# EAGLE design spedo_pcb_1 (EAGLE 6.6.0)
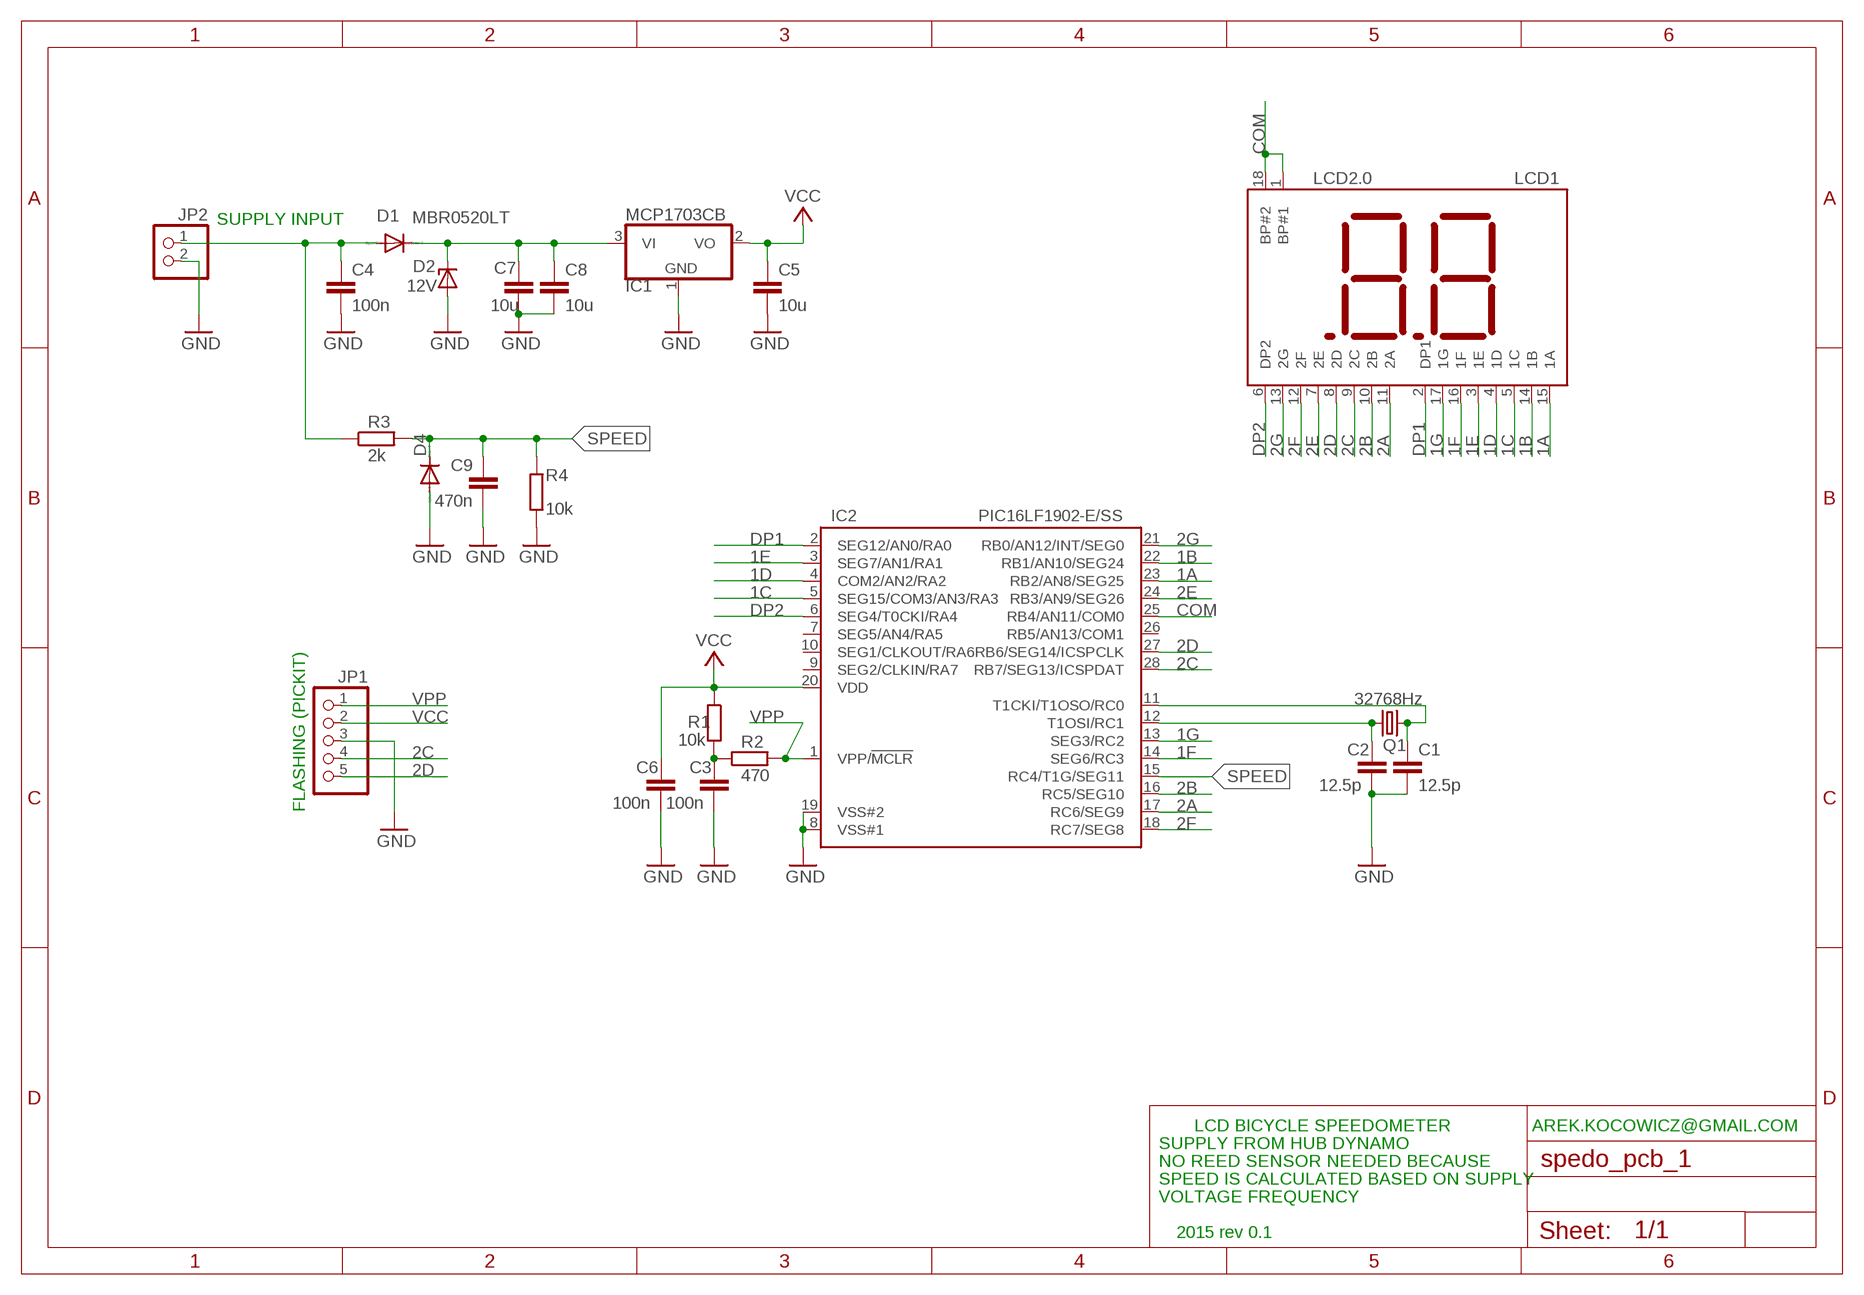
[diagram p0: schematic, sheet 1]

## Parts
C1  12.5p  C-EUC0603K  [C0603K]
C2  12.5p  C-EUC0603K  [C0603K]
C3  100n  C-EUC0603K  [C0603K]
C4  100n  C-EUC0603K  [C0603K]
C5  10u  C-EUC0805K  [C0805K]
C6  100n  C-EUC0603K  [C0603K]
C7  10u  C-EUC0805K  [C0805K]
C8  10u  C-EUC0805K  [C0805K]
C9  470n  C-EUC0603K  [C0603K]
D1  MBR0520LT  [SOD123]
D2  12V  ZENER-DIODESOD80C  [SOD80C]
D4  DIODE-SOD323-W  [SOD323-W]
IC1  MCP1703CB  [SOT23]
IC2  PIC16LF1902-E/SS  [SSOP28]
JP1  PINHD-1X5/90  [1X05/90]
JP2  PINHD-1X2  [1X02]
LCD1  LCD2.0  [LCD2.0]
Q1  32768Hz  CRYSTALTC26H  [TC26H]
R1  10k  R-EU_R0603  [R0603]
R2  470  R-EU_R0603  [R0603]
R3  2k  R-EU_R0603  [R0603]
R4  10k  R-EU_R0603  [R0603]

## Nets
1A: IC2.23(RB2/AN8/SEG25) LCD1.15(1A)
1B: IC2.22(RB1/AN10/SEG24) LCD1.14(1B)
1C: IC2.5(SEG15/COM3/AN3/RA3) LCD1.5(1C)
1D: IC2.4(COM2/AN2/RA2) LCD1.4(1D)
1E: IC2.3(SEG7/AN1/RA1) LCD1.3(1E)
1F: IC2.14(SEG6/RC3) LCD1.16(1F)
1G: IC2.13(SEG3/RC2) LCD1.17(1G)
2A: IC2.17(RC6/SEG9) LCD1.11(2A)
2B: IC2.16(RC5/SEG10) LCD1.10(2B)
2C: IC2.28(RB7/SEG13/ICSPDAT) JP1.4 LCD1.9(2C)
2D: IC2.27(RB6/SEG14/ICSPCLK) JP1.5 LCD1.8(2D)
2E: IC2.24(RB3/AN9/SEG26) LCD1.7(2E)
2F: IC2.18(RC7/SEG8) LCD1.12(2F)
2G: IC2.21(RB0/AN12/INT/SEG0) LCD1.13(2G)
COM: IC2.25(RB4/AN11/COM0) LCD1.1(BP#1) LCD1.18(BP#2)
DP1: IC2.2(SEG12/AN0/RA0) LCD1.2(DP1)
DP2: IC2.6(SEG4/T0CKI/RA4) LCD1.6(DP2)
GND: C1.2 C2.2 C3.2 C4.2 C5.2 C6.2 C7.2 C8.2 C9.2 D2.A D4.A IC1.1(GND) IC2.8(VSS#1) IC2.19(VSS#2) JP1.3 JP2.2 R4.2
N$1: C1.1 IC2.11(T1CKI/T1OSO/RC0) Q1.2
N$2: C2.1 IC2.12(T1OSI/RC1) Q1.1
N$3: C4.1 D1.A JP2.1 R3.1
N$5: C3.1 R1.2 R2.1
N$6: C7.1 C8.1 D1.C D2.C IC1.3(VI)
SPEED: C9.1 D4.C IC2.15(RC4/T1G/SEG11) R3.2 R4.1
VCC: C5.1 C6.1 IC1.2(VO) IC2.20(VDD) JP1.2 R1.1
VPP: IC2.1(VPP/!MCLR) JP1.1 R2.2
Unconnected: IC2.7(SEG5/AN4/RA5) IC2.9(SEG2/CLKIN/RA7) IC2.10(SEG1/CLKOUT/RA6) IC2.26(RB5/AN13/COM1)

## Notes on the sheet
- SUPPLY INPUT
- FLASHING (PICKIT)
- LCD BICYCLE SPEEDOMETER | AREK.KOCOWICZ@GMAIL.COM
- SUPPLY FROM HUB DYNAMO
- NO REED SENSOR NEEDED BECAUSE
- SPEED IS CALCULATED BASED ON SUPPLY
- VOLTAGE FREQUENCY
- 2015 rev 0.1

## Library data of the parts
C1-C9 = rcl:C-EU: CAPACITOR, European symbol
D1 = diode:MBR0520LT: SCHOTTKY BARRIER RECTIFIER Source: http://onsemi.com .. MBR0520LT1-D.pdf
D2 = diode:ZENER-DIODE: Z-Diode
D4 = diode:DIODE-: DIODE
IC1 = linear:MCP1703: 250 mA, 16V, Low Quiescent Current LDO Regulator Source: http://ww1.microchip.com/downloads/en/DeviceDoc/22049b.pdf
IC2 = pic16:PIC16LF1902-E/SS
JP1 = pinhead:PINHD-1X5: PIN HEADER
JP2 = pinhead:PINHD-1X2: PIN HEADER
LCD1 = LCD:LCD2.0
Q1 = crystal:CRYSTAL: CRYSTAL; OC_FARNELL: unknown; OC_NEWARK: unknown
R1-R4 = rcl:R-EU_: RESISTOR, European symbol

## Board
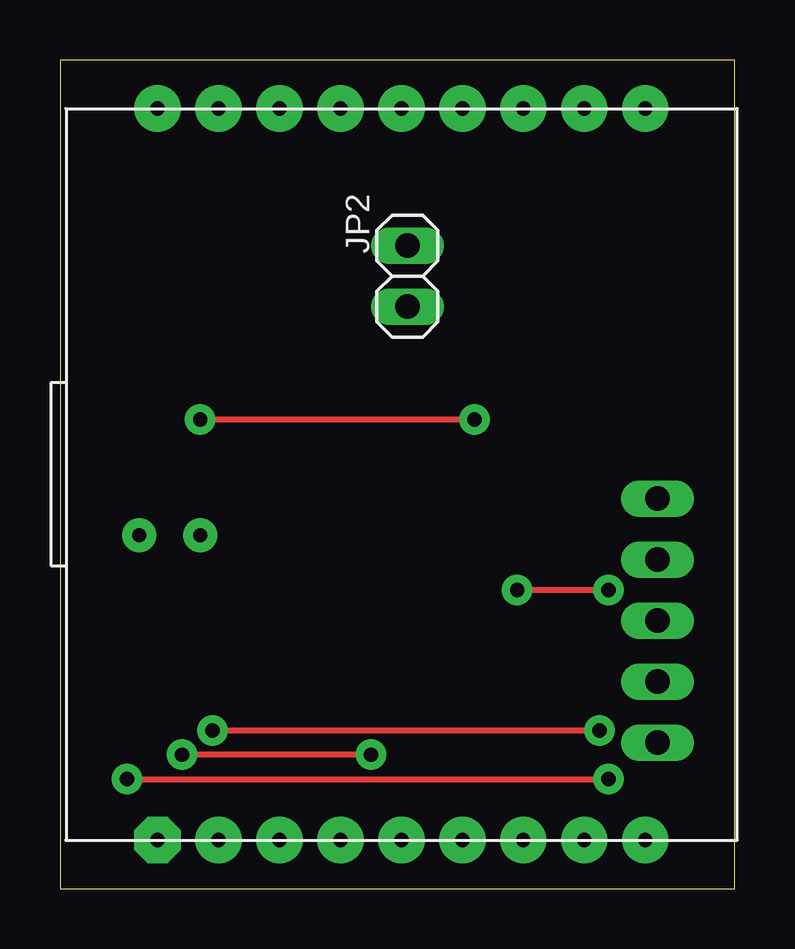
[diagram p1: board, top side]
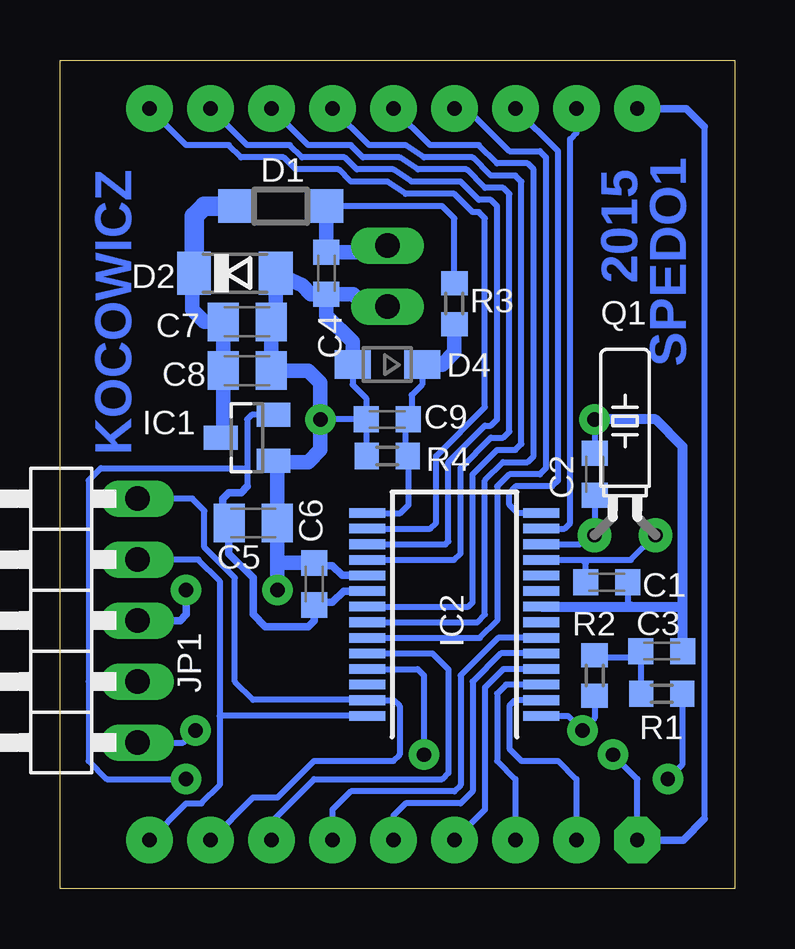
[diagram p2: board, bottom side, seen from below]

Size 28.12 x 34.53 mm. Coordinates in mm from the lower left corner, seen from the top.
Outline: 0,0 28.12,0 28.12,34.53 0,34.53 0,0
Copper layers (1*16): Top 0.035mm / dielectric 1.5mm / Bottom 0.035mm
Design rules "default": minimum track width 10mil, minimum drill 24mil, track to track 8mil, track to pad 8mil, pad to pad 8mil, via to via 8mil, smd to smd 8mil, copper to edge 40mil, drill to drill 8mil, minimum pad ring 10mil, minimum via ring 8mil, stop-mask expansion 4mil, vias tented up to drill 0mil, thermal gap 10mil

### Footprints (pad centres in the part's own frame; a part is rotated, then mirrored left to right if it is on the bottom)
C0603K = smd 1.05 x 1.08: 1 -0.875,0; 2 0.875,0
C0805K = smd 1.3 x 1.6: 1 -1,0; 2 1,0
SOD123 = smd 1.4 x 1.4: A 1.9,0; C -1.9,0
SOD80C = smd 1.4 x 1.8: A 1.7,0; C -1.7,0
SOD323-W = smd 1.5 x 1.2: A 1.45,0; C -1.45,0
SOT23 = smd 1 x 1.4: 1 -0.95,-1.1; 2 0.95,-1.1; 3 0,1.1
SSOP28 = smd 0.4 x 1.5: 1 -4.225,-3.625; 2 -3.575,-3.625; 3 -2.925,-3.625; 4 -2.275,-3.625; 5 -1.625,-3.625; 6 -0.975,-3.625; 7 -0.325,-3.625; 8 0.325,-3.625; 9 0.975,-3.625; 10 1.625,-3.625; 11 2.275,-3.625; 12 2.925,-3.625; 13 3.575,-3.625; 14 4.225,-3.625; 15 4.225,3.625; 16 3.575,3.625; 17 2.925,3.625; 18 2.275,3.625; 19 1.625,3.625; 20 0.975,3.625; 21 0.325,3.625; 22 -0.325,3.625; 23 -0.975,3.625; 24 -1.625,3.625; 25 -2.275,3.625; 26 -2.925,3.625; 27 -3.575,3.625; 28 -4.225,3.625
1X05/90 = drill 1.016 long: 1 -5.08,-3.81; 2 -2.54,-3.81; 3 0,-3.81; 4 2.54,-3.81; 5 5.08,-3.81
1X02 = drill 1.016 long: 1 -1.27,0; 2 1.27,0
LCD2.0 = drill 0.6 pad 1.93 octagon: 1 -10.16,-15.24 | drill 0.6 pad 1.93: 2 -7.62,-15.24; 3 -5.08,-15.24; 4 -2.54,-15.24; 5 0,-15.24; 6 2.54,-15.24; 7 5.08,-15.24; 8 7.62,-15.24; 9 10.16,-15.24; 10 10.16,15.24; 11 7.62,15.24; 12 5.08,15.24; 13 2.54,15.24; 14 0,15.24; 15 -2.54,15.24; 16 -5.08,15.24; 17 -7.62,15.24; 18 -10.16,15.24
TC26H = drill 0.6 pad 1.4: 1 -1.27,0; 2 1.27,0
R0603 = smd 1 x 1.1: 1 -0.85,0; 2 0.85,0

### Placement (x,y rotation side)
C1  5.33,12.78 0 bottom
C2  5.84,17.27 90 bottom
C3  3.05,9.91 0 bottom
C4  17.02,25.65 270 bottom
C5  20.07,15.24 0 bottom
C6  17.53,12.7 90 bottom
C7  20.32,23.62 0 bottom
C8  20.32,21.59 0 bottom
C9  14.48,19.56 180 bottom
D1  18.92,28.45 0 bottom
D2  20.83,25.65 0 bottom
D4  14.48,21.84 180 bottom
IC1  20.32,18.8 90 bottom
IC2  11.68,11.43 90 bottom
JP1  28.7,11.18 90 bottom
JP2  14.48,25.53 270 top
LCD1  14.22,17.27 0 top
Q1  4.57,14.73 0 bottom
R1  3.05,8.13 180 bottom
R2  5.84,8.89 270 bottom
R3  11.68,24.38 270 bottom
R4  14.48,18.03 180 bottom

### Tracks (layer width: path | path; a pad name or v marks a point on that pad's centre or on a via)
1A
  Bottom 0.254: LCD1.15 11.18,32.51 9.4,30.73 8.13,30.73 7.87,30.48 7.87,17.53 8.13,17.27 9.4,17.27 9.91,16.76 9.91,11.18 10.63,10.45 IC2.23
1B
  Bottom 0.254: IC2.22 10.74,11.1 10.41,11.43 10.41,17.02 9.65,17.78 8.64,17.78 8.38,18.03 8.38,29.97 8.64,30.23 9.91,30.23 10.67,30.99 12.7,30.99 LCD1.14
1C
  Bottom 0.254: IC2.5 9.75,9.8 10.92,8.64 10.92,4.06 11.43,3.56 13.72,3.56 14.22,3.05 LCD1.5
1D
  Bottom 0.254: IC2.4 9.64,9.16 10.41,8.38 10.41,3.3 LCD1.4
1E
  Bottom 0.254: IC2.3 9.53,8.51 9.91,8.13 9.91,5.33 9.14,4.57 LCD1.3
1F
  Bottom 0.254: IC2.14 9.05,15.66 9.4,16 9.4,16.51 9.14,16.76 7.62,16.76 7.37,17.02 7.37,30.73 LCD1.16
1G
  Bottom 0.254: LCD1.17 6.6,31.5 6.86,31.24 6.86,15.24 7.09,15.01 IC2.13
2A
  Bottom 0.254: IC2.17 12.06,14.35 11.94,14.48 11.94,17.78 10.41,19.3 10.16,19.3 9.91,19.56 9.91,28.45 10.16,28.7 10.67,28.7 11.43,29.46 13.46,29.46 14.22,29.97 15.75,29.97 16.26,30.48 18.03,30.48 18.54,30.99 20.32,30.99 LCD1.11
2B
  Bottom 0.254: IC2.16 12.68,15.01 12.45,15.24 12.45,18.03 10.41,20.07 10.41,27.94 10.67,28.19 10.92,28.19 11.68,28.96 13.72,28.96 14.48,29.46 16,29.46 16.51,29.97 18.29,29.97 18.8,30.48 20.57,30.48 21.08,30.99 22.86,30.99 LCD1.10
2C
  Bottom 0.254: 21.46,7.2 21.46,12.83 22.35,13.72 JP1.4 | 21.46,7.2 21.46,4.32 22.22,3.56 22.86,3.56 LCD1.9 | IC2.28 21.46,7.2
2D
  Bottom 0.254: LCD1.8 20.07,3.81 19.05,3.81 17.53,5.33 14.22,5.33 13.97,5.59 13.97,7.62 14.21,7.85 IC2.27 15.33,7.87 20.07,7.87 20.83,8.64 20.83,12.95 22.1,14.22 22.1,15.75 22.61,16.26 JP1.5
2E
  Bottom 0.254: IC2.24 12.6,9.8 11.94,9.14 11.94,4.83 12.19,4.57 17.53,4.57 19.3,2.79 LCD1.7
2F
  Bottom 0.254: IC2.18 11.7,13.7 11.43,13.97 11.43,17.53 10.16,18.8 9.65,18.8 9.4,19.05 9.4,28.96 9.65,29.21 10.41,29.21 11.18,29.97 13.21,29.97 13.97,30.48 15.49,30.48 16,30.99 17.78,30.99 LCD1.12
2G
  Bottom 0.254: IC2.21 11.11,11.76 10.92,11.94 10.92,17.27 9.91,18.29 9.14,18.29 8.89,18.54 8.89,29.46 9.14,29.72 10.16,29.72 10.92,30.48 12.95,30.48 13.72,30.99 15.24,30.99 LCD1.13
COM  (via drill 0.6 pad 1.27)
  Top 0.254: v12.95,5.59 v5.08,5.59
  Bottom 0.254: 1.27,31.75 1.27,2.92 | IC2.25 13.22,9.16 12.95,8.89 v12.95,5.59 | v5.08,5.59 4.06,4.57 LCD1.1
  Bottom 0.305: 1.27,2.92 2.16,2.03 LCD1.1 | 1.27,31.75 2.03,32.51 LCD1.18
DP1
  Bottom 0.254: IC2.2 9.16,7.85 9.4,7.62 9.4,5.84 8.89,5.33 7.37,5.33 6.6,4.57 LCD1.2
DP2
  Bottom 0.254: IC2.6 9.86,10.45 11.43,8.89 11.43,4.32 11.68,4.06 16,4.06 16.76,3.3 LCD1.6
GND  (via drill 0.6 pad 1.27)
  Top 0.254: v5.84,19.56 v17.27,19.56 | v22.86,12.45 v19.05,12.45
  Bottom 0.254: 17.41,13.46 C6.2 | 19.13,23.31 C7.2 | 2.24,11.76 2.17,11.68 | C1.2 4.46,11.9 4.32,11.76 | v5.84,19.56 C2.2 | 17.25,19.53 v17.27,19.56 C9.2 | D4.A 15.93,21.01 15.37,20.45 15.37,19.57 C9.2 | R4.2 15.33,19.53 C9.2 | C5.2 18.81,15.24
  Bottom 0.305: IC2.19 16.36,13.05 16.76,13.46 17.41,13.46 | JP1.3 23.11,11.18 22.86,11.43 v22.86,12.45
  Bottom 0.406: C3.2 2.17,11.68 2.17,18.43 3.3,19.56 v5.84,19.56 | IC2.8 4.32,11.76 2.24,11.76
  Bottom 0.61: C4.2 17.67,24.78 18.03,25.15 D2.A 19.13,23.31 | C7.2 C8.2 17.78,21.59 17.27,21.08 v17.27,19.56 17.27,18.29 17.78,17.78 19.15,17.78 IC1.1 19.07,17.69 C5.2 19.07,13.72 | D4.A 15.93,22.79 17.02,23.88 C4.2 | C4.2 15.89,24.78 15.24,24.13 14.61,24.13 JP2.2 | 18.78,15.24 18.8,15.22 18.81,15.24 | C6.2 17.54,13.59 18.94,13.59 19.07,13.72 | 19.07,13.72 19.07,12.72 v19.05,12.45
N$1
  Bottom 0.254: IC2.11 6.35,13.7 | 6.35,13.7 4.33,13.7 Q1.2 | C1.1 6.21,13.56 6.35,13.7
N$2
  Bottom 0.254: IC2.12 6.47,14.35 6.1,14.73 Q1.1 C2.1
N$3
  Bottom 0.254: R3.1 11.68,27.94 12.19,28.45 D1.A
  Bottom 0.406: 16.76,26.42 16.76,26.67 16.9,26.53 C4.1 | 14.61,26.67 JP2.1 | D1.A
  Bottom 0.61: JP2.1 14.75,26.53 C4.1 D1.A
N$5
  Bottom 0.254: R2.1 5.75,9.65 4.18,9.65 C3.1 3.9,9.88 R1.2
N$6
  Bottom 0.61: D2.C 22.61,25.07 22.61,24.13 22.1,23.62 C7.1 C8.1 21.32,18.9 IC1.3
  Bottom 0.813: D2.C 22.53,28.02 22.1,28.45 D1.C
SPEED
  Bottom 0.254: D4.C 13.03,21.01 13.46,20.57 13.46,19.7 C9.1 13.72,19.45 13.72,18.29 13.63,18.2 R4.1 13.59,17.99 13.59,16 13.94,15.66 IC2.15
  Bottom 0.61: R3.2 11.68,22.35 12.19,21.84 D4.C
VCC  (via drill 0.6 pad 1.27)
  Top 0.254: v2.79,4.57 v22.86,4.57
  Bottom 0.254: 17.41,11.94 C6.1 | IC1.2 19.12,19.75 | 20.83,15.22 C5.1 | R1.1 2.2,5.17 v2.79,4.57 | 19.37,19.75 20.13,19.75 20.32,19.56 20.32,17.53 | 20.32,17.53 20.32,16.76 | 20.32,17.53 26.42,17.53 26.92,17.02 26.92,8.64 | JP1.2 26.92,8.64 | 26.92,8.64 26.92,5.33 26.16,4.57 v22.86,4.57
  Bottom 0.305: IC2.20 16.3,12.41 16.76,11.94 17.41,11.94 | 19.12,19.75 19.37,19.75 | 20.32,16.76 20.57,16.51 21.08,16.51 21.34,16.26 21.34,15.26 C5.1 21.08,15.22 21.08,13.97 20.07,12.95 20.07,11.43 19.56,10.92 17.78,10.92 17.53,11.18 C6.1
VPP  (via drill 0.6 pad 1.27)
  Top 0.254: v6.35,6.6 v22.48,6.6 22.35,6.6
  Bottom 0.254: IC2.1 6.95,7.2 v6.35,6.6 5.84,7.11 R2.2 | JP1.1 22.99,6.1 v22.48,6.6

### Text on the board
Bottom: SPEDO1 | 2015 | KOCOWICZ